# EAGLE design GPS TRACKER MINI (EAGLE 9.6.2)
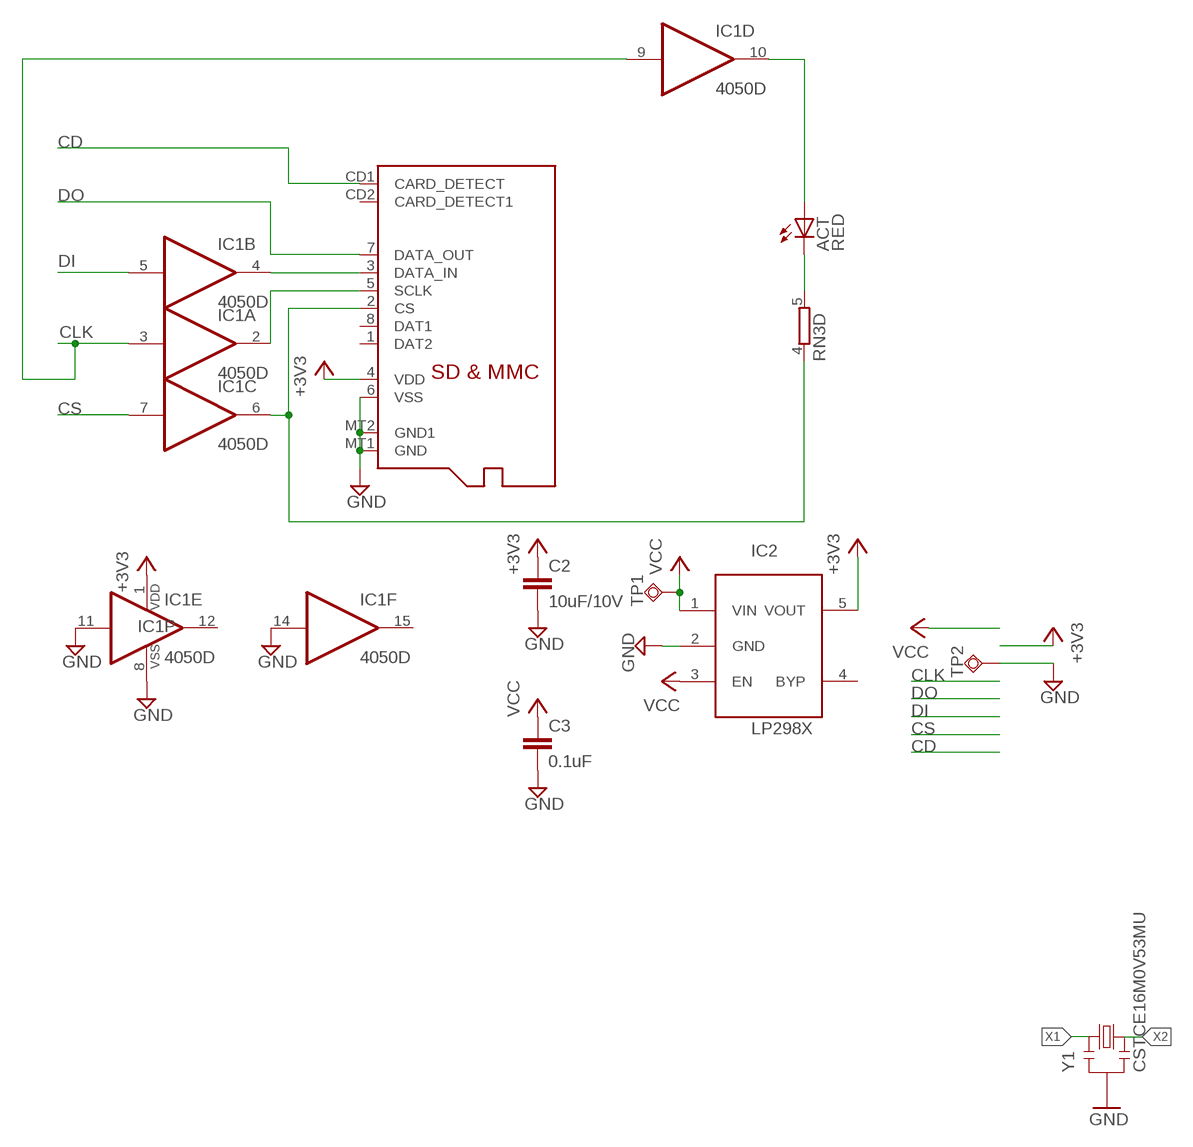
[diagram p0: schematic, sheet 1, part 1 of 2]
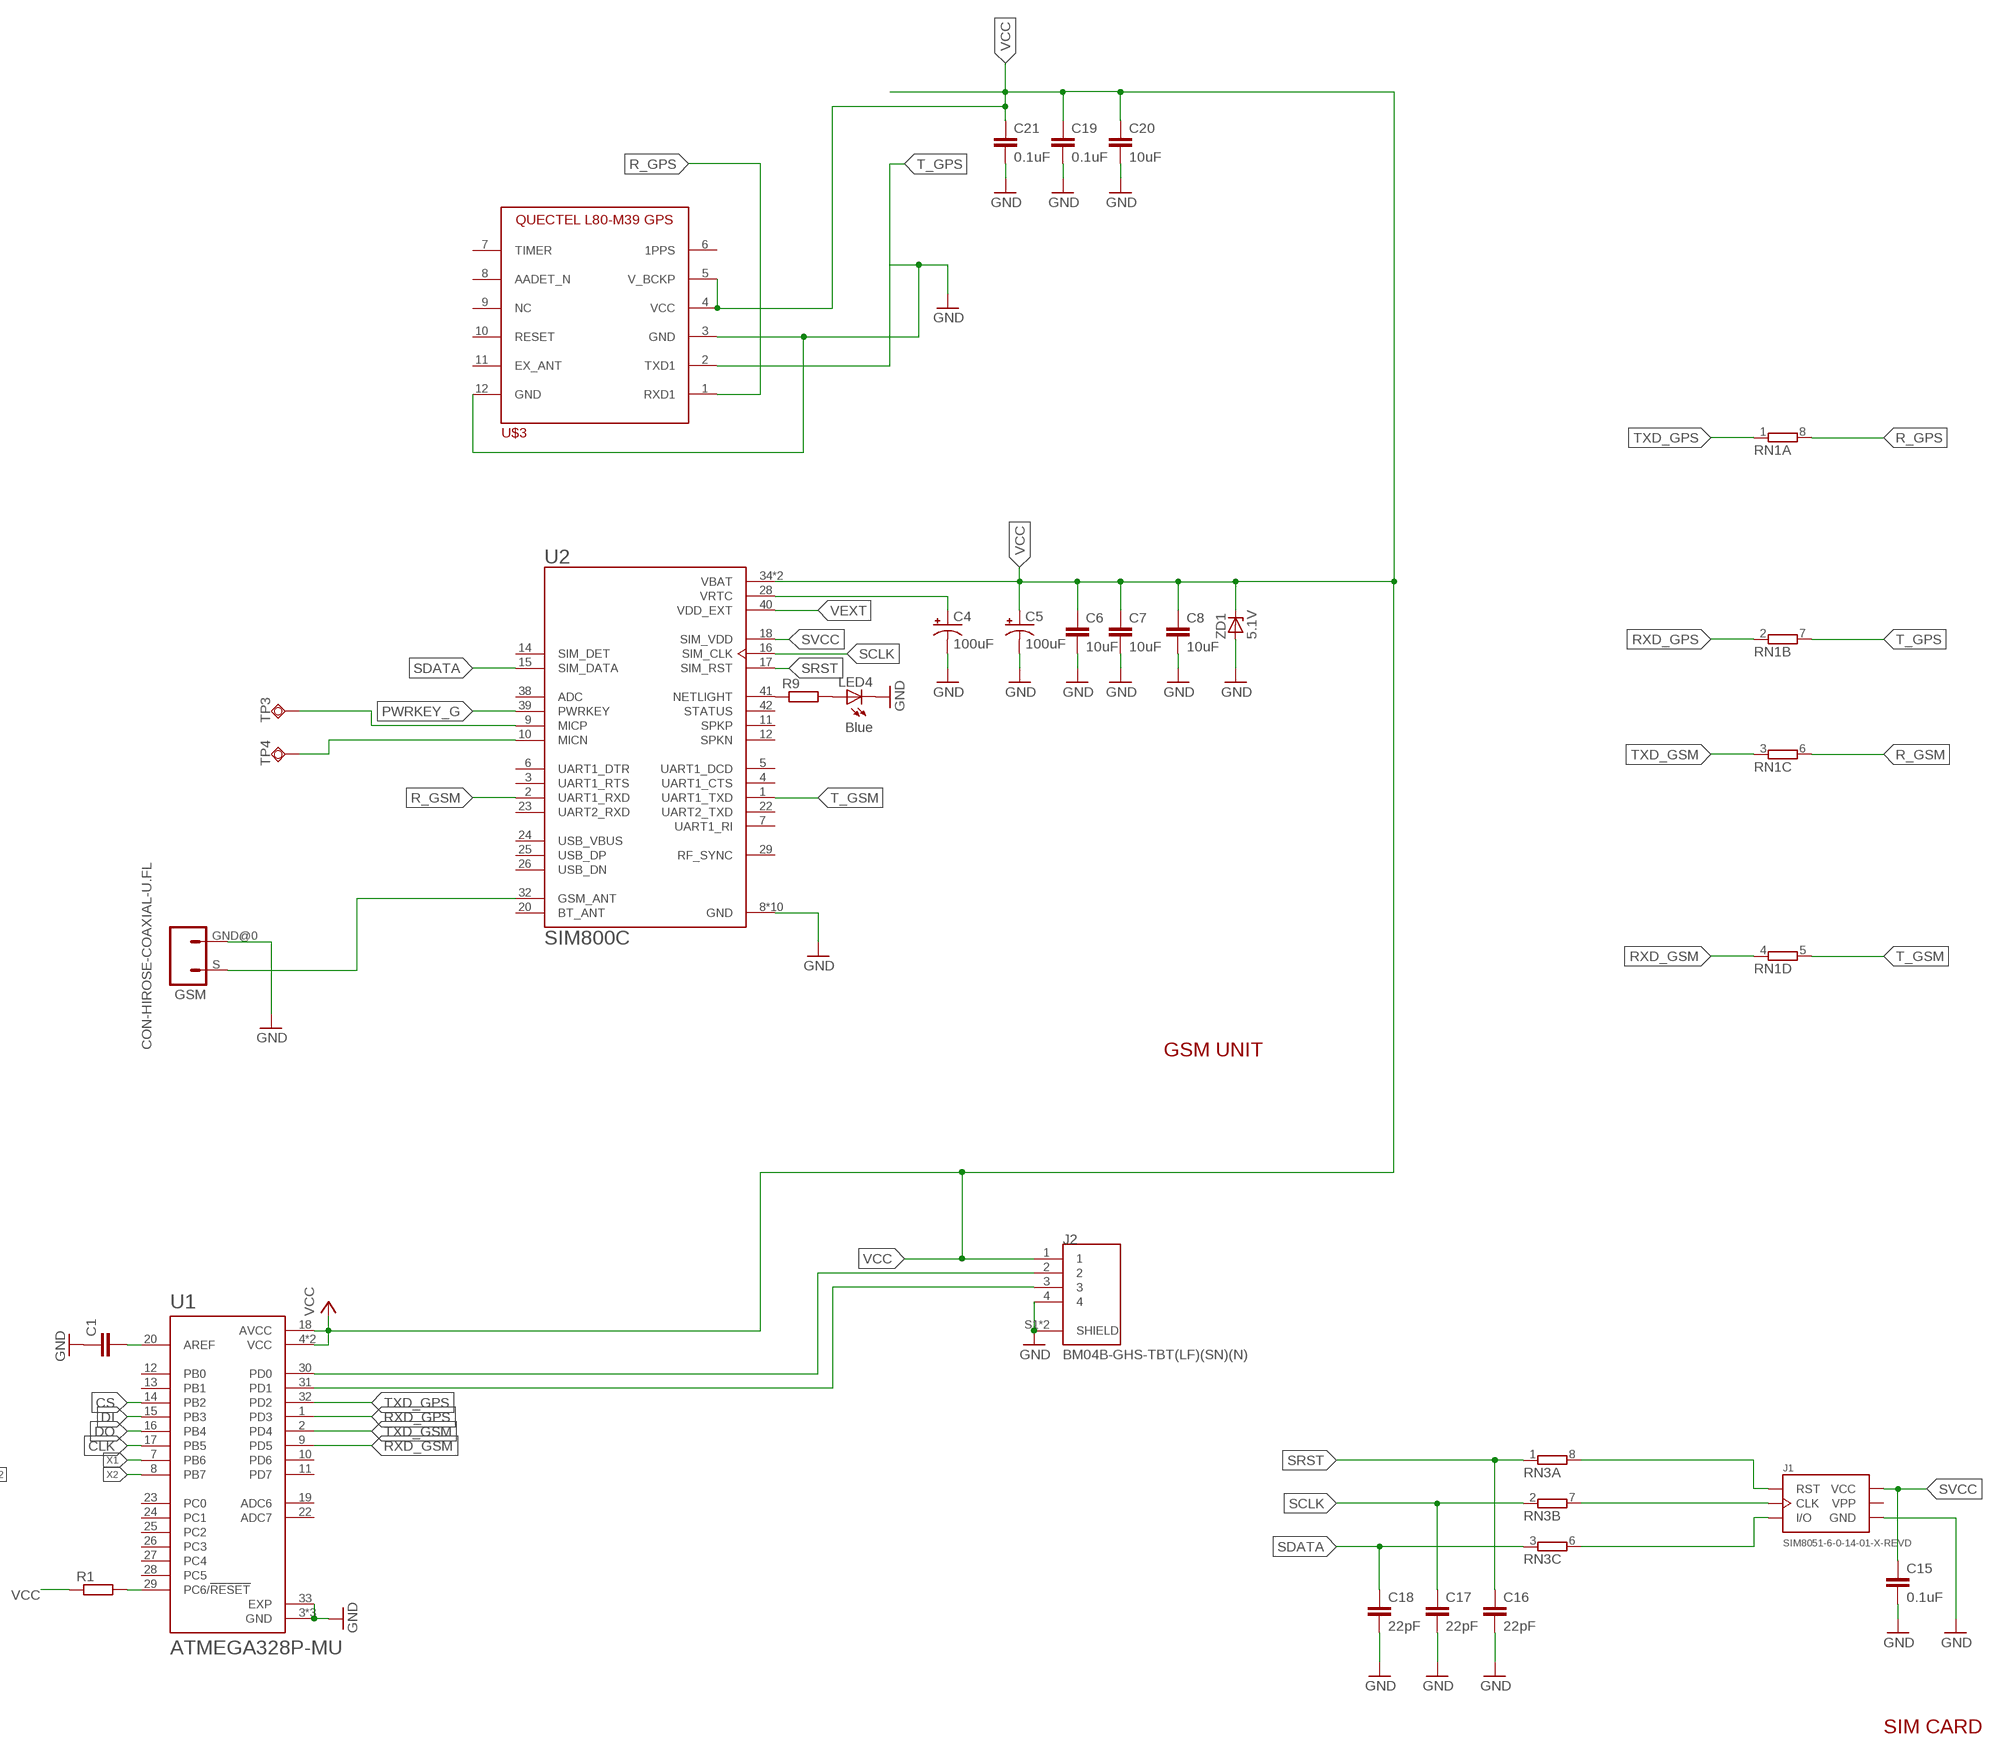
[diagram p1: schematic, sheet 1, part 2 of 2]

## Parts
ACT  RED  LEDCHIP-LED0805  [CHIP-LED0805]
C1  C-EUC0603K  [C0603K]
C2  10uF/10V  C-EUC0603  [C0603]
C3  0.1uF  C-EUC0603  [C0603]
C4  100uF  CPOL-USB/3528-21R  [B/3528-21R]
C5  100uF  CPOL-USB/3528-21R  [B/3528-21R]
C6  10uF  C-EUC0603  [C0603]
C7  10uF  C-EUC0603  [C0603]
C8  10uF  C-EUC0603  [C0603]
C15  0.1uF  C-EUC0603  [C0603]
C16  22pF  C-EUC0603  [C0603]
C17  22pF  C-EUC0603  [C0603]
C18  22pF  C-EUC0603  [C0603]
C19  0.1uF  C-EUC0603  [C0603]
C20  10uF  C-EUC0603  [C0603]
C21  0.1uF  C-EUC0603  [C0603]
GSM  CON-HIROSE-COAXIAL-U.FL  [CON-U.FL]
IC1  4050D  [SO16]
IC2  LP298XS  [SOT23-5L]
J1  SIM8051-6-0-14-01-X-REVD  [GCT_SIM8051-6-0-14-01-X-REVD]
J2  BM04B-GHS-TBT(LF)(SN)(N)  [JST_BM04B-GHS-TBT(LF)(SN)(N)]
LED4  Blue  LEDCHIP-LED0805  [CHIP-LED0805]
R1  R-EU_R0603  [R0603]
R9  R-EU_R0603  [R0603]
RN1  4R-N0603-ARC  [0603-ARC]
RN3  4R-N0603-ARC  [0603-ARC]
TP1  TPSQTP20R  [TP20R]
TP2  TPSQTP20R  [TP20R]
TP3  TPSQTP14R  [TP14R]
TP4  TPSQTP14R  [TP14R]
U1  ATMEGA328P-MU  [QFN50P500X500X100-33N]
U2  SIM800C  [LCC110P1570X1760X250-42N]
U$3  L80_GNSS_MODULE  [L80_PACKAGE]
X1  MICROSD  [MICROSD]
Y1  CSTCE16M0V53MU  [CSTCE16M0V53]
ZD1  5.1V  ZD-SOD123  [SOD123]

## Nets
+3V3: C2.1 IC1.1(P:VDD) IC2.5(VOUT) X1.4(VDD)
CD: X1.CD1(CARD_DETECT)
CLK: IC1.3(A:I) IC1.9(D:I) U1.17(PB5)
CS: IC1.7(C:I) U1.14(PB2)
DI: IC1.5(B:I) U1.15(PB3)
DO: U1.16(PB4) X1.7(DATA_OUT)
GND: C1.1 C2.2 C3.2 C4.- C5.- C6.2 C7.2 C8.2 C15.2 C16.2 C17.2 C18.2 C19.2 C20.2 C21.2 GSM.GND@0 IC1.8(P:VSS) IC1.11(E:I) IC1.14(F:I) IC2.2(GND) J1.C5(GND) J2.4 J2.S1(SHIELD) J2.S2(SHIELD) LED4.C TP2.TP U1.3(GND) U1.5(GND) U1.21(GND) U1.33(EXP) U2.8(GND) U2.13(GND) U2.19(GND) U2.21(GND) U2.27(GND) U2.30(GND) U2.31(GND) U2.33(GND) U2.36(GND) U2.37(GND) U$3.3(GND) U$3.12(GND) X1.6(VSS) X1.MT1(GND) X1.MT2(GND1) Y1.2 ZD1.A
N$1: ACT.A IC1.10(D:O)
N$2: C1.2 U1.20(AREF)
N$3: IC1.2(A:O) X1.5(SCLK)
N$4: IC1.6(C:O) RN3.4 X1.2(CS)
N$5: ACT.C RN3.5
N$6: IC1.4(B:O) X1.3(DATA_IN)
N$7: R9.1 U2.41(NETLIGHT)
N$8: LED4.A R9.2
N$9: J2.2 U1.30(PD0)
N$10: J2.3 U1.31(PD1)
N$11: TP3.TP U2.9(MICP)
N$12: TP4.TP U2.10(MICN)
N$13: R1.2 U1.29(PC6/!RESET)
N$15: C4.+ U2.28(VRTC)
N$17: GSM.S U2.32(GSM_ANT)
N$19: J1.C2(RST) RN3.8
N$20: J1.C3(CLK) RN3.7
N$21: J1.C7(I/O) RN3.6
PWRKEY_G: U2.39(PWRKEY)
R_GPS: RN1.8 U$3.1(RXD1)
R_GSM: RN1.6 U2.2(UART1_RXD)
RXD_GPS: RN1.2 U1.1(PD3)
RXD_GSM: RN1.4 U1.9(PD5)
SCLK: C17.1 RN3.2 U2.16(SIM_CLK)
SDATA: C18.1 RN3.3 U2.15(SIM_DATA)
SRST: C16.1 RN3.1 U2.17(SIM_RST)
SVCC: C15.1 J1.C1(VCC) U2.18(SIM_VDD)
T_GPS: RN1.7 U$3.2(TXD1)
T_GSM: RN1.5 U2.1(UART1_TXD)
TXD_GPS: RN1.1 U1.32(PD2)
TXD_GSM: RN1.3 U1.2(PD4)
VCC: C3.1 C5.+ C6.1 C7.1 C8.1 C19.1 C20.1 C21.1 IC2.1(VIN) IC2.3(EN) J2.1 R1.1 TP1.TP U1.4(VCC) U1.6(VCC) U1.18(AVCC) U2.34(VBAT) U2.35(VBAT) U$3.4(VCC) U$3.5(V_BCKP) ZD1.C
VEXT: U2.40(VDD_EXT)
X1: U1.7(PB6) Y1.1
X2: U1.8(PB7) Y1.3
Unconnected: IC1.12(E:O) IC1.15(F:O) IC2.4(BYP) U1.10(PD6) U1.11(PD7) U1.12(PB0) U1.13(PB1) U1.19(ADC6) U1.22(ADC7) U1.23(PC0) U1.24(PC1) U1.25(PC2) U1.26(PC3) U1.27(PC4) U1.28(PC5) U2.3(UART1_RTS) U2.4(UART1_CTS) U2.5(UART1_DCD) U2.6(UART1_DTR) U2.7(UART1_RI) U2.11(SPKP) U2.12(SPKN) U2.14(SIM_DET) U2.20(BT_ANT) U2.22(UART2_TXD) U2.23(UART2_RXD) U2.24(USB_VBUS) U2.25(USB_DP) U2.26(USB_DN) U2.29(RF_SYNC) U2.38(ADC) U2.42(STATUS) U$3.6(1PPS) U$3.7(TIMER) U$3.8(AADET_N) U$3.9(NC) U$3.10(RESET) U$3.11(EX_ANT) X1.1(DAT2) X1.8(DAT1) X1.CD2(CARD_DETECT1)

## Notes on the sheet
- GSM UNIT
- SIM CARD

## Power pins joined to a net without a drawn wire
VPP: J1.C6(VPP)

## Library data of the parts
ACT LED4 = adafruit:LED: LED OSRAM: - CHIPLED LG R971, LG N971, LY N971, LG Q971, LY Q971, LO R971, LY R971 LH N974, LH R974 LS Q976, LO Q976, LY Q976 LO Q996 - Hyper CHIPLED LW Q18S LB Q993, LB Q99A, LB R99A - SideLED LS A670, LO A670, LY A670, LG A670, LP A670 LB A673, LV A673, LT A673, LW A673 LH A674 LY A675 LS A676, LA A676, LO A676, LY A676, LW A676 LS A679, LY A679, LG A679 - Hyper Micro SIDELED® LS Y876, LA Y876, LO Y876, LY Y876 LT Y87S - SmartLED LW L88C, LW L88S LB L89C, LB L89S, LG L890 LS L89K, LO L89K, LY L89K LS L896, LA L896, LO L896, LY L896 - TOPLED LS T670, LO T670, LY T670, LG T670, LP T670 LSG T670, LSP T670, LSY T670, LOP T670, LYG T670 LG T671, LOG T671, LSG T671 LB T673, LV T673, LT T673, LW T673 LH T674 LS T676, LA T676, LO T676, LY T676, LB T676, LH T676, LSB T676, LW T676 LB T67C, LV T67C, LT T67C, LS T67K, LO T67K, LY T67K, LW E67C LS E67B, LA E67B, LO E67B, LY E67B, LB E67C, LV E67C, LT E67C LW T67C LS T679, LY T679, LG T679 LS T770, LO T770, LY T770, LG T770, LP T770 LB T773, LV T773, LT T773, LW T773 LH T774 LS E675, LA E675, LY E675, LS T675 LS T776, LA T776, LO T776, LY T776, LB T776 LHGB T686 LT T68C, LB T68C - Hyper Mini TOPLED® LB M676 - Mini TOPLED Santana® LG M470 LS M47K, LO M47K, LY M47K Source: http://www.osram.convergy.de/
C1-C3 C6-C8 C15-C21 = rcl:C-EU: CAPACITOR, European symbol; SPICEPREFIX: C
C4 C5 = adafruit:CPOL-US: POLARIZED CAPACITOR, American symbol
GSM = m-pad-2.1:CON-HIROSE-COAXIAL: Hirose SMT 50 ohm impedance connector W.FL ............................. 1.4mm mated height, ultra small SMT connectors .................................. DC to 3GHz U.FL .............................. 1.9mm or 2.4mm mated height, ultra small SMT connectors ................... DC to 6GHz E.FL ............................... 3.2mm mated height, ultra small SMT connectors .................................. DC to 2GHz H.FL .............................. 3.0mm mated height, ultra small SMT connectors ................................... DC to 3GHz S.FL. ............................. 6.0mm mated height, SMT connectors ................................................... DC to 2.5GHz FL ................................. 10.5mm mated height, SMT connectors .................................................. DC to 1.5GHz Please send any comments to: messi@users.sourceforge.net
IC1 = 40xx:4050: Hex non-inverting BUFFER
IC2 = adafruit:LP298X
J1 = SIM8051-6-0-14-01-X-REVD:SIM8051-6-0-14-01-X-REVD: Nano SIM Card Connector, Push-Pull Type, 6 Pin, SMT, Profile 1.35mm; AVAILABILITY: Good; DESCRIPTION: SIM Nano Push Pull%2C 6P%2C 1.35mmH%2C with logo%2C 3 %22 gold%2C with peg%2C T%26R; MF: Global Connector Technology; MP: SIM8051-6-0-14-01-A; PACKAGE: None; PRICE: 0.72 USD
J2 = BM04B-GHS-TBT_LF__SN__N_:BM04B-GHS-TBT(LF)(SN)(N): Conn Shrouded Header HDR 4 POS 1.25mm Solder ST SMD Reel Check availability <https://pricing.snapeda.com/parts/BM04B-GHS-TBT%28LF%29%28SN%29%28N%29/JST%20Sales/view-part?ref=eda>; AVAILABILITY: In Stock; DESCRIPTION: Connector Header Surface Mount 4 position 0.049 (1.25mm); MF: JST Sales; MP: BM04B-GHS-TBT(LF)(SN)(N); PACKAGE: None; PRICE: None; PURCHASE-URL: https://pricing.snapeda.com/search/part/BM04B-GHS-TBT(LF)(SN)(N)/?ref=eda
R1 R9 = rcl:R-EU_: RESISTOR, European symbol; SPICEPREFIX: R
RN1 RN3 = resistor-dil:4R-N: Array Chip Resistor Source: RS Component / Phycomp; OC_FARNELL: unknown; OC_NEWARK: unknown
TP1-TP4 = testpad:TPSQ: Test pad
U1 = ATMEGA328P-MU:ATMEGA328P-MU: ATmega Series 20 MHz 32 KB Flash 2 KB SRAM 8-Bit Microcontroller - QFN-32 Check availability <https://pricing.snapeda.com/parts/ATMEGA328P-MU/Microchip/view-part?ref=eda>; AVAILABILITY: In Stock; DESCRIPTION: AVR AVR® ATmega Microcontroller IC 8-Bit 20MHz 32KB (16K x 16) FLASH 32-VQFN (5x5); MF: Microchip; MP: ATMEGA328P-MU; PACKAGE: VQFN-32 Microchip Technology; PRICE: None; PURCHASE-URL: https://pricing.snapeda.com/search/part/ATMEGA328P-MU/?ref=eda
U2 = SIM800C:SIM800C: Module: GSM/Bluetooth; GPRS; 2G; 1800MHz, 900MHz; 85.6kbps; SMD; AVAILABILITY: Warning; DESCRIPTION: Module: GSM/Bluetooth; GPRS; 2G; 1800MHz, 900MHz; 85.6kbps; SMD; MF: Simcom; MP: SIM800C; PACKAGE: None; PRICE: 6.39 USD
U$3 = Quectel:L80_GNSS_MODULE: GPS module with an embedded patch antenna (15mmx15mmx4mm)
X1 = adafruit:MICROSD: Micro-SD / Transflash card holder with SPI pinout For the 3M # 2908-05WB-MG and/or 4UCON #19656 push-push type
Y1 = CSTCE16M0V53:CSTCE16M0V53: CSTCE16M0V53 Ceramic Resonator (CERALOCK) 16 MHz Chip Type Check availability <https://pricing.snapeda.com/parts/CSTCE16M0V53/Murata%20Electronics/view-part?ref=eda>; AVAILABILITY: In Stock; DESCRIPTION: 16 MHz Ceramic Resonator Built in Capacitor 15 pF ±0.15% -40°C ~ 125°C Surface Mount; MF: Murata Electronics; MP: CSTCE16M0V53; PACKAGE: SMD-3 Murata; PRICE: None; PURCHASE-URL: https://pricing.snapeda.com/search/part/CSTCE16M0V53/?ref=eda
ZD1 = diodes:ZD-: Zener diode

## Board
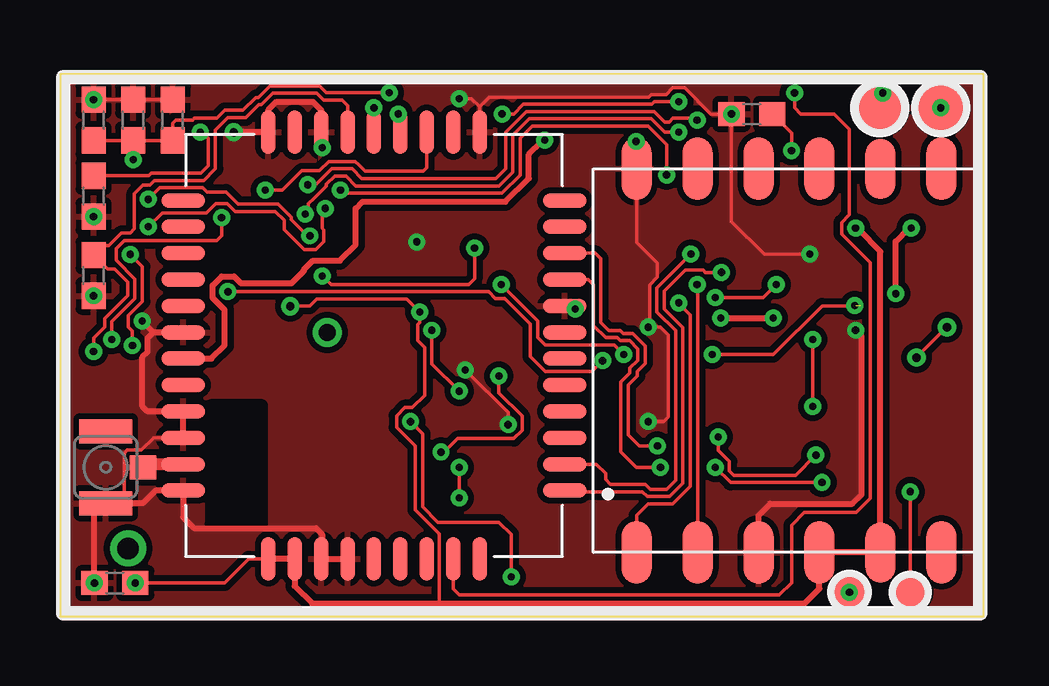
[diagram p2: board, top side]
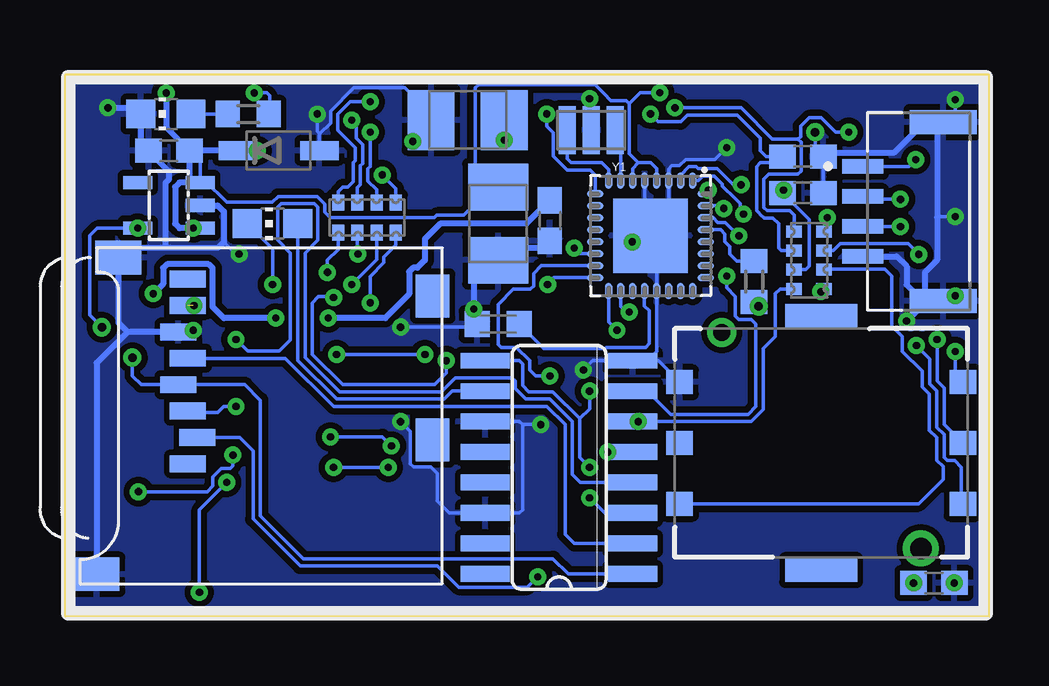
[diagram p3: board, bottom side, seen from below]

Size 38.48 x 22.61 mm. Coordinates in mm from the lower left corner, seen from the top.
Outline: 0,0 38.48,0 38.48,22.61 0,22.61 0,0
Copper layers (1*16): Top 0.035mm / dielectric 1.5mm / Bottom 0.035mm
Design rules "default *": minimum track width 6mil, minimum drill 0.35mm, track to track 6mil, track to pad 6mil, pad to pad 6mil, via to via 6mil, smd to smd 6mil, copper to edge 10mil, drill to drill 6mil, minimum pad ring 10mil, minimum via ring 8mil, stop-mask expansion 4mil, vias tented up to drill 0mil, thermal gap 10mil

### Footprints (pad centres in the part's own frame; a part is rotated, then mirrored left to right if it is on the bottom)
CHIP-LED0805 = smd 1.2 x 1.2: A 0,-1.05; C 0,1.05
C0603K = smd 1.05 x 1.08: 1 -0.875,0; 2 0.875,0
C0603 = smd 1.1 x 1: 1 -0.85,0; 2 0.85,0
B/3528-21R = smd 1.95 x 2.5: + 1.525,0; - -1.525,0
CON-U.FL = smd 1 x 2.2: GND@0 -1.5,0; GND@1 1.5,0 | smd 1 x 1.1: S 0,-1.55
SO16 = smd 0.66 x 2.032: 1 -4.445,-3.073; 2 -3.175,-3.073; 3 -1.905,-3.073; 4 -0.635,-3.073; 5 0.635,-3.073; 6 1.905,-3.073; 7 3.175,-3.073; 8 4.445,-3.073; 9 4.445,3.073; 10 3.175,3.073; 11 1.905,3.073; 12 0.635,3.073; 13 -0.635,3.073; 14 -1.905,3.073; 15 -3.175,3.073; 16 -4.445,3.073
SOT23-5L = smd 0.55 x 1.2: 1 -0.95,-1.3; 2 0,-1.3; 3 0.95,-1.3; 4 0.95,1.3; 5 -0.95,1.3
GCT_SIM8051-6-0-14-01-X-REVD = drill 0.9 pad 1.5: 1 -4.4,-4.15 | drill 0.7 pad 1.2: 2 4.6,4.15 | smd 1 x 3: 6 5.3,0; 10 -5.3,0 | smd 1 x 1.1: C1 2.54,-5.9; C2 0,-5.9; C3 -2.54,-5.9; C5 2.54,5.9; C6 0,5.9; C7 -2.54,5.9
JST_BM04B-GHS-TBT(LF)(SN)(N) = smd 0.6 x 1.7: 1 1.875,3.35; 2 0.625,3.35; 3 -0.625,3.35; 4 -1.875,3.35 | smd 1 x 2.8: S1 -3.725,0; S2 3.725,0
R0603 = smd 1 x 1.1: 1 -0.85,0; 2 0.85,0
0603-ARC = smd 0.5 x 0.65: 1 -1.2,-0.625; 2 -0.4,-0.625; 3 0.4,-0.625; 4 1.2,-0.625; 5 1.2,0.625; 6 0.4,0.625; 7 -0.4,0.625; 8 -1.2,0.625
TP20R = smd 2 x 2: TP 0,0
TP14R = smd 1.4 x 1.4: TP 0,0
QFN50P500X500X100-33N = smd 0.7 x 0.3: 1 -2.3,1.75; 2 -2.3,1.25; 3 -2.3,0.75; 4 -2.3,0.25; 5 -2.3,-0.25; 6 -2.3,-0.75; 7 -2.3,-1.25; 8 -2.3,-1.75; 17 2.3,-1.75; 18 2.3,-1.25; 19 2.3,-0.75; 20 2.3,-0.25; 21 2.3,0.25; 22 2.3,0.75; 23 2.3,1.25; 24 2.3,1.75 | smd 0.3 x 0.7: 9 -1.75,-2.3; 10 -1.25,-2.3; 11 -0.75,-2.3; 12 -0.25,-2.3; 13 0.25,-2.3; 14 0.75,-2.3; 15 1.25,-2.3; 16 1.75,-2.3; 25 1.75,2.3; 26 1.25,2.3; 27 0.75,2.3; 28 0.25,2.3; 29 -0.25,2.3; 30 -0.75,2.3; 31 -1.25,2.3; 32 -1.75,2.3 | smd 3.1 x 3.1: 33 0,0
LCC110P1570X1760X250-42N = smd 1.8 x 0.6: 1 -7.95,6.05; 2 -7.95,4.95; 3 -7.95,3.85; 4 -7.95,2.75; 5 -7.95,1.65; 6 -7.95,0.55; 7 -7.95,-0.55; 8 -7.95,-1.65; 9 -7.95,-2.75; 10 -7.95,-3.85; 11 -7.95,-4.95; 12 -7.95,-6.05; 22 7.95,-6.05; 23 7.95,-4.95; 24 7.95,-3.85; 25 7.95,-2.75; 26 7.95,-1.65; 27 7.95,-0.55; 28 7.95,0.55; 29 7.95,1.65; 30 7.95,2.75; 31 7.95,3.85; 32 7.95,4.95; 33 7.95,6.05 | smd 0.6 x 1.8: 13 -4.4,-8.9; 14 -3.3,-8.9; 15 -2.2,-8.9; 16 -1.1,-8.9; 17 0,-8.9; 18 1.1,-8.9; 19 2.2,-8.9; 20 3.3,-8.9; 21 4.4,-8.9; 34 4.4,8.9; 35 3.3,8.9; 36 2.2,8.9; 37 1.1,8.9; 38 0,8.9; 39 -1.1,8.9; 40 -2.2,8.9; 41 -3.3,8.9; 42 -4.4,8.9
L80_PACKAGE = smd 2.6 x 1.25: 1 16,1.8; 2 16,4.34; 3 16,6.88; 4 16,9.42; 6 16,14.5; 7 0,14.5; 9 0,9.42; 10 0,6.88; 11 0,4.34; 12 0,1.8 | smd 2.5 x 1.25: 5 16,11.96; 8 0,11.96
MICROSD = smd 0.7 x 1.5: 1 9,-10.64; 2 7.9,-10.24; 3 6.8,-10.64; 4 5.7,-11.04; 5 4.6,-10.64; 6 3.5,-11.04; 7 2.4,-10.64; 8 1.3,-10.64 | smd 1.8 x 1.4: CD1 2,-0.44; CD2 8,-0.44 | smd 1.4 x 1.9: MT1 0.4,-13.54; MT2 13.6,-14.44
CSTCE16M0V53 = smd 0.7 x 2: 1 0.45,1.688; 2 1.45,1.688; 3 2.45,1.688
SOD123 = smd 1.6 x 0.8: A 1.7,0; C -1.7,0

### Placement (x,y rotation side)
ACT  29.84,16.38 90 bottom
C1  20.45,12.19 0 bottom
C2  18.29,16.51 270 bottom
C3  34.16,19.43 180 bottom
C4  21.72,20.7 0 bottom
C5  20.45,16.38 90 bottom
C6  28.83,20.95 180 top
C7  4.7,20.7 90 top
C8  3.05,20.7 90 top
C15  1.4,14.22 270 top
C16  1.4,17.53 270 top
C17  7.75,19.18 0 bottom
C18  7.75,17.65 0 bottom
C19  2.29,1.4 180 top
C20  1.4,20.7 90 top
C21  2.29,1.4 0 bottom
GSM  1.9,6.22 90 top
IC1  17.91,6.22 90 bottom
IC2  34.16,17.14 90 bottom
J1  6.98,7.24 90 bottom
J2  1.9,16.89 90 bottom
LED4  34.29,20.95 90 bottom
R1  9.78,13.97 90 bottom
R9  30.86,20.95 180 bottom
RN1  25.91,16.64 180 bottom
RN3  7.49,14.86 270 bottom
TP1  34.16,21.21 0 top
TP2  36.7,21.21 0 top
TP3  32.89,1.02 0 top
TP4  35.43,1.02 0 top
U1  14.1,15.88 270 bottom
U2  13.08,11.3 180 top
U$3  22.23,18.67 270 top
X1  22.73,15.37 270 bottom
Y1  15.11,21.97 180 bottom
ZD1  29.59,19.43 0 bottom

### Tracks (layer width: path | path; a pad name or v marks a point on that pad's centre or on a via)
+3V3  (via drill 0.3, 0.35)
  Top 0.152: v36.96,12.06 v35.69,10.79
  Top 0.254: v34.82,13.46 34.82,15.64 35.37,16.2 IC2.5 | v27.53,12.45 v29.72,12.45
  Bottom 0.152: IC1.1 17.53,1.78 18.16,2.41 28.57,2.41 30.35,4.19 30.35,9.02 31,9.67 X1.4 35.32,9.67 35.69,10.03 v35.69,10.79 | IC2.5 37.15,16.2 37.46,15.88 37.46,12.57 v36.96,12.06
  Bottom 0.254: C2.1 19.27,16.38 22.86,16.38 23.5,15.75 23.5,14.86 23.81,14.55 23.99,14.55 24.15,14.38 24.15,13.44 25.15,12.45 v27.53,12.45 | v29.72,12.45 31.88,12.45 32.34,12.91 32.34,14.53 32.51,14.7 34.24,14.7 34.4,14.53 34.4,13.86 34.8,13.46 v34.82,13.46
  other vias: 35.46,16.2
CLK  (via drill 0.3)
  Top 0.152: v16.64,6.22 v16.64,4.95 | v15.49,11.94 15.49,10.54 v16.64,9.4
  Bottom 0.152: IC1.9 19.56,10.67 19.43,10.54 19.43,9.63 19.18,9.37 18.16,9.37 17.04,8.25 | v16.64,6.22 17.04,6.63 17.04,8.25 | v16.64,4.95 16,4.32 IC1.3 | U1.17 15.85,12.29 v15.49,11.94 | v16.64,9.4 16.64,8.66 17.04,8.25
CS  (via drill 0.3)
  Top 0.152: v17.27,15.37 17.27,14.1 17.02,13.85 11.3,13.85 10.95,14.2 v10.92,14.2
  Bottom 0.152: U1.14 17.03,15.12 v17.27,15.37 | IC1.7 14.71,9.52 14.35,9.52 13.26,8.43 10.03,8.43 9.7,8.76 9.7,12.19 9.91,12.39 10.42,12.39 10.56,12.52 10.56,13.35 10.92,13.72 v10.92,14.2
DI  (via drill 0.3)
  Top 0.152: v18.29,10.03 18.29,9.32 19.25,8.36 19.25,7.76 18.91,7.42 16.56,7.42 16,6.86 v15.88,6.86
  Bottom 0.152: U1.15 18.65,14.62 18.97,14.31 18.97,13.79 19.1,13.65 19.81,13.65 20.45,13.02 20.45,12.19 20.45,11.35 20.32,11.23 19.69,11.23 19.13,10.67 19.13,10.29 18.87,10.03 v18.29,10.03 | v15.88,6.86 IC1.5
DO  (via drill 0.3)  (1 unrouted)
  Top 0.152: v18.39,13.84 19.9,12.33 19.9,11.63 20.21,11.32 23.09,11.32 23.37,11.05 23.37,10.92 v23.49,10.92 | v27.18,10.92 29.72,10.92 31.75,12.95 33.15,12.95 33.16,12.97 v33.12,12.97
  Bottom 0.152: U1.16 18.13,14.12 18.41,13.84 v18.39,13.84 | v23.49,10.92 v27.18,10.92
GND  (via drill 0.3, 0.35)
  Top 0.152: v16.89,10.29 18.67,8.51 v18.67,8 | 17.48,21.25 U2.13 | U2.31 3.9,7.45 3.4,6.95 2.81,6.95 2.67,6.81 2.67,4.72 | U2.19 10.88,19.73 10.92,19.68 v10.92,19.56 | v21.46,12.83 21.16,12.83 U2.8 | v24.51,8.13 25.15,8.13 25.35,8.33 25.35,11.74 25.02,12.06 v24.51,12.06 24.57,12.12 24.57,13.82 24.89,14.15 24.89,14.73 24.02,15.6 U$3.12 24.02,19.28 v24,19.81 | C20.2 C8.2 C7.2 | 17.48,21.25 17.89,21.67 24.54,21.67 24.64,21.77 25.26,21.77 25.54,22.04 26.02,22.04 27.11,20.95 C6.2 27.98,16.47 29.34,15.11 v31.24,15.11 | v16.64,21.59 17.14,21.59 17.48,21.25
  Top 0.254: U2.27 3.9,11.85 | 3.9,11.85 v3.43,12.32 | v7.24,20.19 8.67,20.19 U2.21 8.68,21.13 9.02,21.46 10.54,21.46 10.88,21.12 U2.19 | U2.31 U2.30 3.64,8.55 3.43,8.76 3.43,10.82 3.65,11.04 3.65,11.61 3.9,11.85 | U$3.3 29.11,4.21 29.59,4.7 33.02,4.7 33.4,5.08 33.4,11.69 v33.15,11.94 | C21.2 1.44,4.72 GSM.GND@0 2.67,4.72 3.45,4.72 3.98,5.25 U2.33 5.13,4.14 5.59,3.68 10.67,3.68 10.92,3.43 10.92,2.4 | U2.36 10.92,2.4 | 10.92,2.4 U2.37
  Bottom 0.152: IC1.11 19.56,8.13 19.43,8 | 19.43,8 19.43,4.45 19.56,4.32 IC1.14 22.48,4.32 22.99,4.83 22.99,5.97 23.26,6.24 23.97,6.24 24.1,6.37 24.1,7.72 v24.51,8.13 | IC1.8 14.22,10.67 13.85,11.04 U1.21 13.85,16.13 13.97,16.26 | J1.C5 13.77,10.67 IC1.8 | IC1.8 16.51,10.67 v16.89,10.29 | v18.67,8 19.43,8 | 13.97,16.26 U1.33 14.86,15.88 v14.86,15.62 | 13.97,16.26 13.33,16.89 13.33,17.14 13.35,17.16 U1.3 13.35,18.66 13.21,18.8 12.89,18.8 12.63,19.06 11.42,19.06 v10.92,19.56 | U1.5 14.35,16.64 13.97,16.26 | v16.64,21.59 16.56,21.52 Y1.2 | C18.2 C17.2 7.24,19.52 v7.24,20.19 | v21.46,12.83 21.34,12.83 21.32,12.81 C1.1 21.45,12.06 v24.51,12.06 | 35.34,19.76 C3.2 | 1.27,13.21 1.23,13.17 | 1.14,13.08 1.23,13.17 | 1.23,13.17 1.52,13.17 | 1.52,13.17 J2.S1 | v1.4,13.37 1.4,13.29 1.52,13.17 | C16.2 2.12,16.68 2.16,16.64 | ZD1.A 27.89,20.11 27.88,20.13 | 27.88,20.13 27.43,20.58 27.43,21.07 26.45,22.04 24.33,22.04 23.24,20.96 C4.- 23.24,20.19 23.11,20.07 23.37,19.81 v24,19.81 | 1.9,21.04 1.9,20.7 | 1.9,20.7 J2.S2 | C20.2 1.4,20.83 1.52,20.7 1.9,20.7 | C6.2 27.98,20.23 27.88,20.13 | v31.24,15.11 31.37,15.11 31.88,15.62
  Bottom 0.254: 35.88,11.87 X1.6 33.22,11.87 v33.15,11.94 | X1.MT2 37.17,10.58 35.88,11.87 | 35.88,11.87 36.27,12.25 X1.MT1 35.87,15.37 34.29,15.37 | IC2.2 32.13,17.14 31.88,16.89 31.88,15.62 32.13,15.37 34.29,15.37 | J2.S1 2.07,13.33 2.67,13.33 | v3.43,12.32 2.67,13.08 | 2.67,13.08 2.67,13.33 | J2.4 3.84,15.02 3.43,14.6 3.43,13.84 2.67,13.08 | 2.92,20.7 2.84,20.62 2.67,20.62 | 2.67,20.62 J2.S2 2.16,20.36 2.16,16.64 2.16,14.86 2.67,14.35 2.67,13.33 | 35.34,19.76 LED4.C 35.59,21.21 TP2.TP | C17.2 6.73,19.34 3.94,19.34 2.67,20.62 | C2.2 18.71,15.37 19.94,15.37 C5.- 20.7,14.86 21.46,14.1 v21.46,12.83 | C3.2 34.16,18.58 34.16,18.23 34.31,18.07 34.31,15.39 34.29,15.37
  other vias: 1.4,16.68 1.44,1.4 1.4,21.55 27.98,20.95 36.7,21.21
  pour Top (isolate 0.254): 0,22.61 38.48,22.61 38.48,0 0,0
  pour Bottom (isolate 0.254): 0,22.61 38.48,22.61 38.48,0 0,0
N$1
  Bottom 0.152: IC1.10 22.35,9.4 22.68,9.07 27.18,9.07 28.79,10.68 ACT.A
N$2
  Bottom 0.152: C1.2 18.56,11.18 15.99,11.18 15.94,11.23 14.3,11.23 14.15,11.38 14.15,12.75 14.35,12.95 U1.20
N$3
  Bottom 0.152: X1.5 29.31,10.77 27.3,8.76 18.41,8.76 17.65,8 17.65,3.43 17.27,3.05 IC1.2
N$4  (via drill 0.3)
  Top 0.152: v18.8,1.65 18.8,3.43 18.29,3.94 15.75,3.94 15.11,4.57 15.11,7.62 v14.61,8.13
  Bottom 0.152: IC1.6 v14.61,8.13 9.91,8.13 9.4,8.64 9.4,11.18 8.89,11.68 8.89,13.46 8.69,13.66 RN3.4 | X1.2 31.22,7.47 30.66,6.91 30.66,4.07 28.7,2.11 22.98,2.11 22.09,1.22 19.23,1.22 v18.8,1.65
N$5  (via drill 0.3)
  Top 0.152: v7,13.54 17.86,13.54 18.15,13.26 18.54,13.26 19.6,12.2 19.6,10.84 20.21,10.22 22.16,10.22 v22.61,10.67 | v27.3,13.3 29.31,13.3 v29.84,13.84
  Bottom 0.152: RN3.5 6.86,13.66 v7,13.54 | v27.3,13.3 27.34,13.33 27.93,13.33 28.18,13.08 28.18,10.94 26.93,9.68 23.09,9.68 22.61,10.16 v22.61,10.67 | v29.84,13.84 29.84,15.33 ACT.C
N$6  (via drill 0.3)
  Top 0.152: v31.37,11.56 v31.37,8.76
  Bottom 0.152: IC1.4 17.02,5.59 17.35,5.92 17.35,8.13 18.29,9.07 19.3,9.07 19.74,9.5 19.74,9.82 19.87,9.96 22.22,9.96 22.81,9.37 27.05,9.37 28.49,10.81 28.49,15.16 27.97,15.69 27.97,17.08 28.1,17.21 29.49,17.21 29.62,17.08 29.62,15.69 29.1,15.16 29.1,11.54 29.57,11.07 30.88,11.07 v31.37,11.56 | v31.37,8.76 31.88,8.76 32.13,8.51 33.31,8.51 X1.3
N$7  (via drill 0.3)
  Top 0.152: U2.41 16.38,1.16 16.64,0.9 29.97,0.9 30.48,1.41 30.48,3.81 31.01,4.34 33.17,4.34 33.75,4.93 33.75,14.77 32.56,15.95 32.56,16.44 32.89,16.76 32.89,20.32 32.26,20.95 30.86,20.95 30.61,21.21 v30.61,21.83
  Bottom 0.152: v30.61,21.83 30.09,21.83 29.97,21.72 29.97,20.99 R9.1
N$8
  Bottom 0.152: LED4.A 32.26,20.95 R9.2
N$9  (via drill 0.3)
  Top 0.152: v3.68,17.4 4.17,17.88 5.95,17.88 6.13,17.7 6.92,17.7 7.43,17.2 9.09,17.2 9.64,16.65 9.64,16.55 10.31,15.88 v10.41,15.88
  Bottom 0.152: v3.68,17.4 5.14,17.4 J2.2 | U1.30 11.48,16.62 11.29,16.44 10.97,16.44 v10.41,15.88
N$10  (via drill 0.3)
  Top 0.152: v3.68,16.26 4.25,16.82 6.1,16.82 6.49,17.22 6.97,17.22 7.3,16.89 8.97,16.89 9.34,16.52 9.34,16.13 10.17,15.29 10.66,15.29 11,15.63 11,16.12 10.92,16.19 10.92,16.89 v11.05,17.02 11.12,17.07
  Bottom 0.152: v3.68,16.26 3.8,16.27 J2.3 | U1.31 11.2,17.12 v11.05,17.02
N$11  (via drill 0.3)
  Top 0.152: v31.75,5.59 27.94,5.59 v27.3,6.22 | v25.02,6.22 24,6.22 23.37,6.86 23.37,9.78 23.75,10.16 23.75,10.35 24.08,10.68 24.08,11.16 23.73,11.5 23.34,11.5 23.22,11.63 22.73,11.63 22.23,12.14 22.23,13.84 22.02,14.05 U2.9
  Bottom 0.152: TP3.TP 32.89,4.45 v31.75,5.59 | v27.3,6.22 v25.02,6.22
  other vias: 32.89,1.02
N$12  (via drill 0.3)
  Top 0.152: TP4.TP v35.43,5.21 | v31.5,6.73 30.66,5.89 28.07,5.89 27.89,6.07 27.89,6.46 27.43,6.92 v27.43,7.49 | v24.89,7.11 24.13,7.11 23.67,7.57 23.67,9.65 24.05,10.03 24.05,10.23 24.38,10.55 24.38,11.29 23.86,11.81 23.47,11.81 23.34,11.93 22.86,11.93 22.53,12.26 22.53,14.93 22.31,15.15 U2.10
  Bottom 0.152: v35.43,5.21 32.56,5.21 32.33,5.44 32.33,5.83 31.99,6.17 31.6,6.17 31.5,6.27 v31.5,6.73 | v27.43,7.49 25.27,7.49 v24.89,7.11
N$13
  Bottom 0.152: U1.29 11.17,16.12 11,15.95 11,15.63 10.79,15.43 10.79,15.11 10.5,14.82 R1.2
N$15  (via drill 0.3)
  Top 0.254: U2.28 6.31,10.75 6.86,11.3 6.86,12.79 6.36,13.28 6.36,13.81 6.73,14.18 7.26,14.18 7.54,13.9 9.65,13.9 10.16,14.41 10.16,14.46 10.53,14.84 11.66,14.84 12.32,15.49 12.32,17.02 12.6,17.3 18.56,17.3 19.53,18.27 19.53,19.28 20.07,19.81 20.14,19.81 v20.19,19.86
  Bottom 0.254: v20.19,19.86 C4.+
N$17
  Top 0.508: U2.32 3.58,6.35 GSM.S
N$19  (via drill 0.3)
  Top 0.152: v6.73,16.64 6.73,15.88 6.54,15.68 2.68,15.68 2.34,15.34 2.34,14.86 3.12,14.07 3.12,13.27 2.16,12.3 v2.16,11.56
  Bottom 0.152: J1.C2 1.86,8.02 1.86,9.52 2.16,9.82 v2.16,11.56 | v6.73,16.64 6.73,16.18 RN3.8
N$20  (via drill 0.3)
  Top 0.152: v2.92,15.1 3.43,14.59 3.43,13.14 2.85,12.56 2.85,12.08 3.02,11.91 v3.02,11.3
  Bottom 0.152: RN3.7 6.48,15.26 6.2,15.54 3.35,15.54 2.92,15.11 v2.92,15.1 | v3.02,11.3 2.46,10.75 2.46,9.69 2.17,9.4 2.17,7.89 1.86,7.59 1.86,6.64 1.73,6.51 1.43,6.51 1.14,6.22 1.14,4.76 J1.C3
N$21
  Bottom 0.152: J1.C7 2.92,4.7 1.9,5.71 1.9,6.25 2.17,6.52 2.17,7.46 2.47,7.77 2.47,9.27 2.77,9.57 2.77,10.23 3.6,11.06 3.6,11.67 4.04,12.11 4.04,14.2 4.33,14.49 6.84,14.49 RN3.6
R_GPS  (via drill 0.3)
  Top 0.152: U$3.1 24.02,4.21 24.51,4.7 25.53,4.7 26.26,5.43 26.26,12.57 25.78,13.05 v25.78,13.08
  Bottom 0.152: v25.78,13.08 25.78,14.17 25.2,14.75 25.2,14.99 24.71,15.48 RN1.8
R_GSM  (via drill 0.3)
  Top 0.152: U2.2 22.35,6.35 22.73,5.97 22.73,5.71 22.94,5.51 24.38,5.51 24.59,5.31 25.27,5.31 | 25.27,5.31 | 25.27,5.31 25.65,5.69 25.65,11.92 24.87,12.7 24.87,13.69 v26.29,15.11
  Bottom 0.152: 26.29,15.87 RN1.6 26.31,15.26 v26.29,15.11
RXD_GPS  (via drill 0.3)
  Top 0.152: v25.78,20.19 25.53,20.19 25.2,20.19 24.64,20.75 19.56,20.75 18.87,20.06 18.87,18.54 18.29,17.96 12.33,17.96 11.93,18.36 11.44,18.36 11.1,18.02 11.1,17.96 10.57,17.42 10.56,17.42 10.35,17.21 10.35,16.91 v10.22,16.79
  Bottom 0.152: v25.78,20.19 25.78,18.77 25.88,18.67 25.88,18.16 25.51,17.79 RN1.2 | 12.32,18.2 U1.1 12.11,18.18 11.93,18.36 11.44,18.36 11.1,18.02 11.1,17.96 10.57,17.42 10.56,17.42 10.35,17.21 10.35,16.91 v10.22,16.79
RXD_GSM  (via drill 0.3)
  Top 0.152: v25.78,21.46 24.77,21.46 24.66,21.36 19.31,21.36 18.9,20.95 v18.42,20.95
  Bottom 0.152: RN1.4 27.11,17.72 26.92,17.91 26.72,17.91 26.49,18.14 26.49,18.92 26.39,19.02 26.39,19.55 27.12,20.28 27.12,20.94 26.6,21.46 v25.78,21.46 | v18.42,20.95 18.42,20.45 18.14,20.17 18.14,19.19 17.57,18.62 16.61,18.62 16.4,18.4 U1.9
SCLK  (via drill 0.3)
  Top 0.152: v14.1,20.95 14.18,20.87 U2.16
  Bottom 0.152: RN3.2 8.66,15.26 8.76,15.37 8.76,16.38 9,16.62 9.37,16.62 9.52,16.77 9.58,16.83 9.68,16.93 9.68,17.14 9.68,18.77 9.52,18.92 8.85,18.92 C17.1 9.27,19.18 9.52,19.43 9.52,19.94 10.49,20.9 12.56,20.9 12.84,20.63 13.77,20.63 v14.1,20.95
SDATA  (via drill 0.3)
  Top 0.152: v8.55,17.78 9.27,17.78 10.08,18.59 10.8,18.59 11.19,18.97 12.3,18.97 12.46,18.81 12.71,18.57 15.14,18.57 15.28,18.71 U2.15
  Bottom 0.152: RN3.3 7.64,14.46 7.49,14.6 7.49,16.55 C18.1 8.55,17.7 v8.55,17.78
SRST  (via drill 0.3)
  Top 0.152: v13.08,21.21 U2.17 | C16.1 3.7,18.38 3.81,18.49 5.87,18.49 6.17,18.79 6.17,19.94 5.92,20.19 v5.84,20.19
  Bottom 0.152: RN3.1 8.12,16.74 8.3,16.92 9.24,16.92 9.38,17.06 9.38,18.25 9.18,18.45 7.95,18.45 7.82,18.58 7.82,19.77 7.95,19.91 | 7.95,19.91 9.02,19.91 10.32,21.21 v13.08,21.21 | 7.95,19.91 7.85,20.01 7.85,20.44 7.49,20.8 6.99,20.8 6.38,20.19 v5.84,20.19
SVCC  (via drill 0.3)
  Top 0.152: U2.18 11.98,21.29 11.75,21.52 10.98,21.52 10.69,21.82 8.87,21.82 8.39,21.34 8.28,21.34 7.75,20.8 6.99,20.8 6.48,20.29 6.48,18.67 5.99,18.19 3.94,18.19 3.73,17.98 3.44,17.98 3.1,17.64 3.1,16.17 2.92,15.99 2.55,15.99 2.03,15.47 1.79,15.47 C15.1 1.99,14.48 2.29,14.48 2.82,13.95 2.82,13.39 1.85,12.43 1.85,12.07 1.4,11.62 v1.4,11.05
  Bottom 0.152: J1.C1 1.4,10.09 v1.4,11.05
T_GPS  (via drill 0.3)
  Top 0.152: U$3.2 26.57,13.82 v26.54,13.84
  Bottom 0.152: v26.54,13.84 25.51,14.88 RN1.7
T_GSM  (via drill 0.3)
  Top 0.152: U2.1 21.08,5.21 24.26,5.21 24.46,5 25.4,5 25.95,5.56 25.95,12.05 25.17,12.83 25.17,13.57 26.06,14.45 26.79,14.45 26.89,14.35 v27.56,14.35
  Bottom 0.152: v27.56,14.35 27.56,14.86 27.11,15.31 RN1.5
TXD_GPS  (via drill 0.3)
  Top 0.152: v25.27,18.41 25.27,19.68 24.51,20.45 19.68,20.45 19.18,19.94 19.18,18.41 18.41,17.65 11.81,17.65 v11.68,17.78
  Bottom 0.152: RN1.1 24.71,17.85 v25.27,18.41 | 11.68,17.86 v11.68,17.78 11.56,17.86 U1.32
TXD_GSM  (via drill 0.3)
  Top 0.152: v26.54,20.7 26.47,20.77 25.54,20.77 25.39,20.62 25.2,20.62 24.76,21.06 19.43,21.06 18.57,20.19 18.57,18.67 18.16,18.26 12.58,18.26 12.18,18.67 11.32,18.67 10.65,18 v10.32,18
  Bottom 0.152: 12.83,18.2 U1.2 12.85,18.41 12.5,18.75 12.19,18.75 12.1,18.67 11.32,18.67 10.65,18 v10.32,18 | v26.54,20.7 26.36,20.52 26.36,19.95 26.09,19.68 26.09,18.89 26.18,18.79 26.18,18.01 26.31,17.89 RN1.3
VCC  (via drill 0.3, 0.35)
  Top 0.152: C21.1 6.86,1.4 7.87,2.41 8.67,2.41 U2.34 | C20.1 C8.1 | C6.1 30.48,20.15 v30.48,19.43 | C8.1 C7.1 4.7,20.57 4.83,20.7 5.53,20.7 5.6,20.77 6.08,20.77 6.53,20.77 6.86,21.11 7.62,21.11 8.16,21.64 8.26,21.64 8.74,22.12 10.81,22.12 11.09,21.84 v13.72,21.84 | C8.1 v3.05,19.05 | 15.88,0.55 15.81,0.61 15.81,3.44 14.81,4.45 14.81,7.11 14.37,7.55 14.36,7.55 14.02,7.89 14.02,8.37 14.36,8.71 14.68,8.71 15.19,9.22 15.19,11.23 14.91,11.5 14.91,12.18 14.99,12.25 v14.99,12.7 14.45,13.24 10.7,13.24 10.4,12.94 v9.59,12.94
  Top 0.254: U2.34 U2.35 9.78,1.27 10.5,0.55 15.88,0.55 31.03,0.55 31.64,1.17 U$3.4 U$3.5 34.19,15.22 33.27,16.13 33.21,16.13 v33.15,16.2 | TP1.TP 34.16,21.72 v34.28,21.83
  Bottom 0.152: IC2.3 32.86,18.16 | 32.86,18.16 32.86,18.98 33.23,19.35 C3.1 ZD1.C v30.48,19.43 | U1.4 13.85,18.67 14.1,18.92 14.61,18.92 | U1.6 14.85,18.68 14.61,18.92 | 32.86,18.16 32.64,18.16 31.75,17.27 29.86,17.27 29.62,17.52 27.97,17.52 27.66,17.2 27.66,16.87 27.43,16.64 23.11,16.64 23.01,16.74 21.87,16.74 21.46,17.14 21.21,17.14 C5.+ 21.4,18.86 21.4,22.05 21.26,22.18 16.4,22.18 16.05,21.83 16.05,21.82 15.75,21.51 15.12,21.51 14.98,21.38 | U1.18 15.35,12.93 15.11,12.7 v14.99,12.7 | v3.05,19.05 3.33,18.77 J2.1 | 14.61,18.92 14.98,19.3 14.98,21.38 | v13.72,21.84 14.52,21.84 14.98,21.38 | R1.1 v9.6,12.94 v9.59,12.94
  Bottom 0.254: IC2.1 v33.15,16.2 33.72,16.2 33.91,16.38 33.91,17.91 33.72,18.09 33.27,18.09 | IC2.3 33.27,18.09 | ZD1.C 33.15,19.43 33.23,19.35 | C5.+ 20.83,17.91 21.46,18.54 | 33.27,18.09 33.31,18.13 C3.1 34.28,20.4 v34.28,21.83
  other vias: 3.14,1.4
X1
  Bottom 0.152: U1.7 15.35,20.07 Y1.1
X2
  Bottom 0.152: U1.8 15.85,18.64 16.13,18.92 17.4,18.92 17.56,19.09 Y1.3